# EasyEDA Pro project LuxcampBadge2025.epro, schematic Schematic

## Sheets
1 P1: Board Name: Board; Create Date: 2025-07-12; Page Name: P1; Project Name: Luxcamp Badge 2025; Schematic Name: Schematic; Update Date: 2025-07-19; Company: EasyEDA.com; Page Size: A4; Version: V1.0
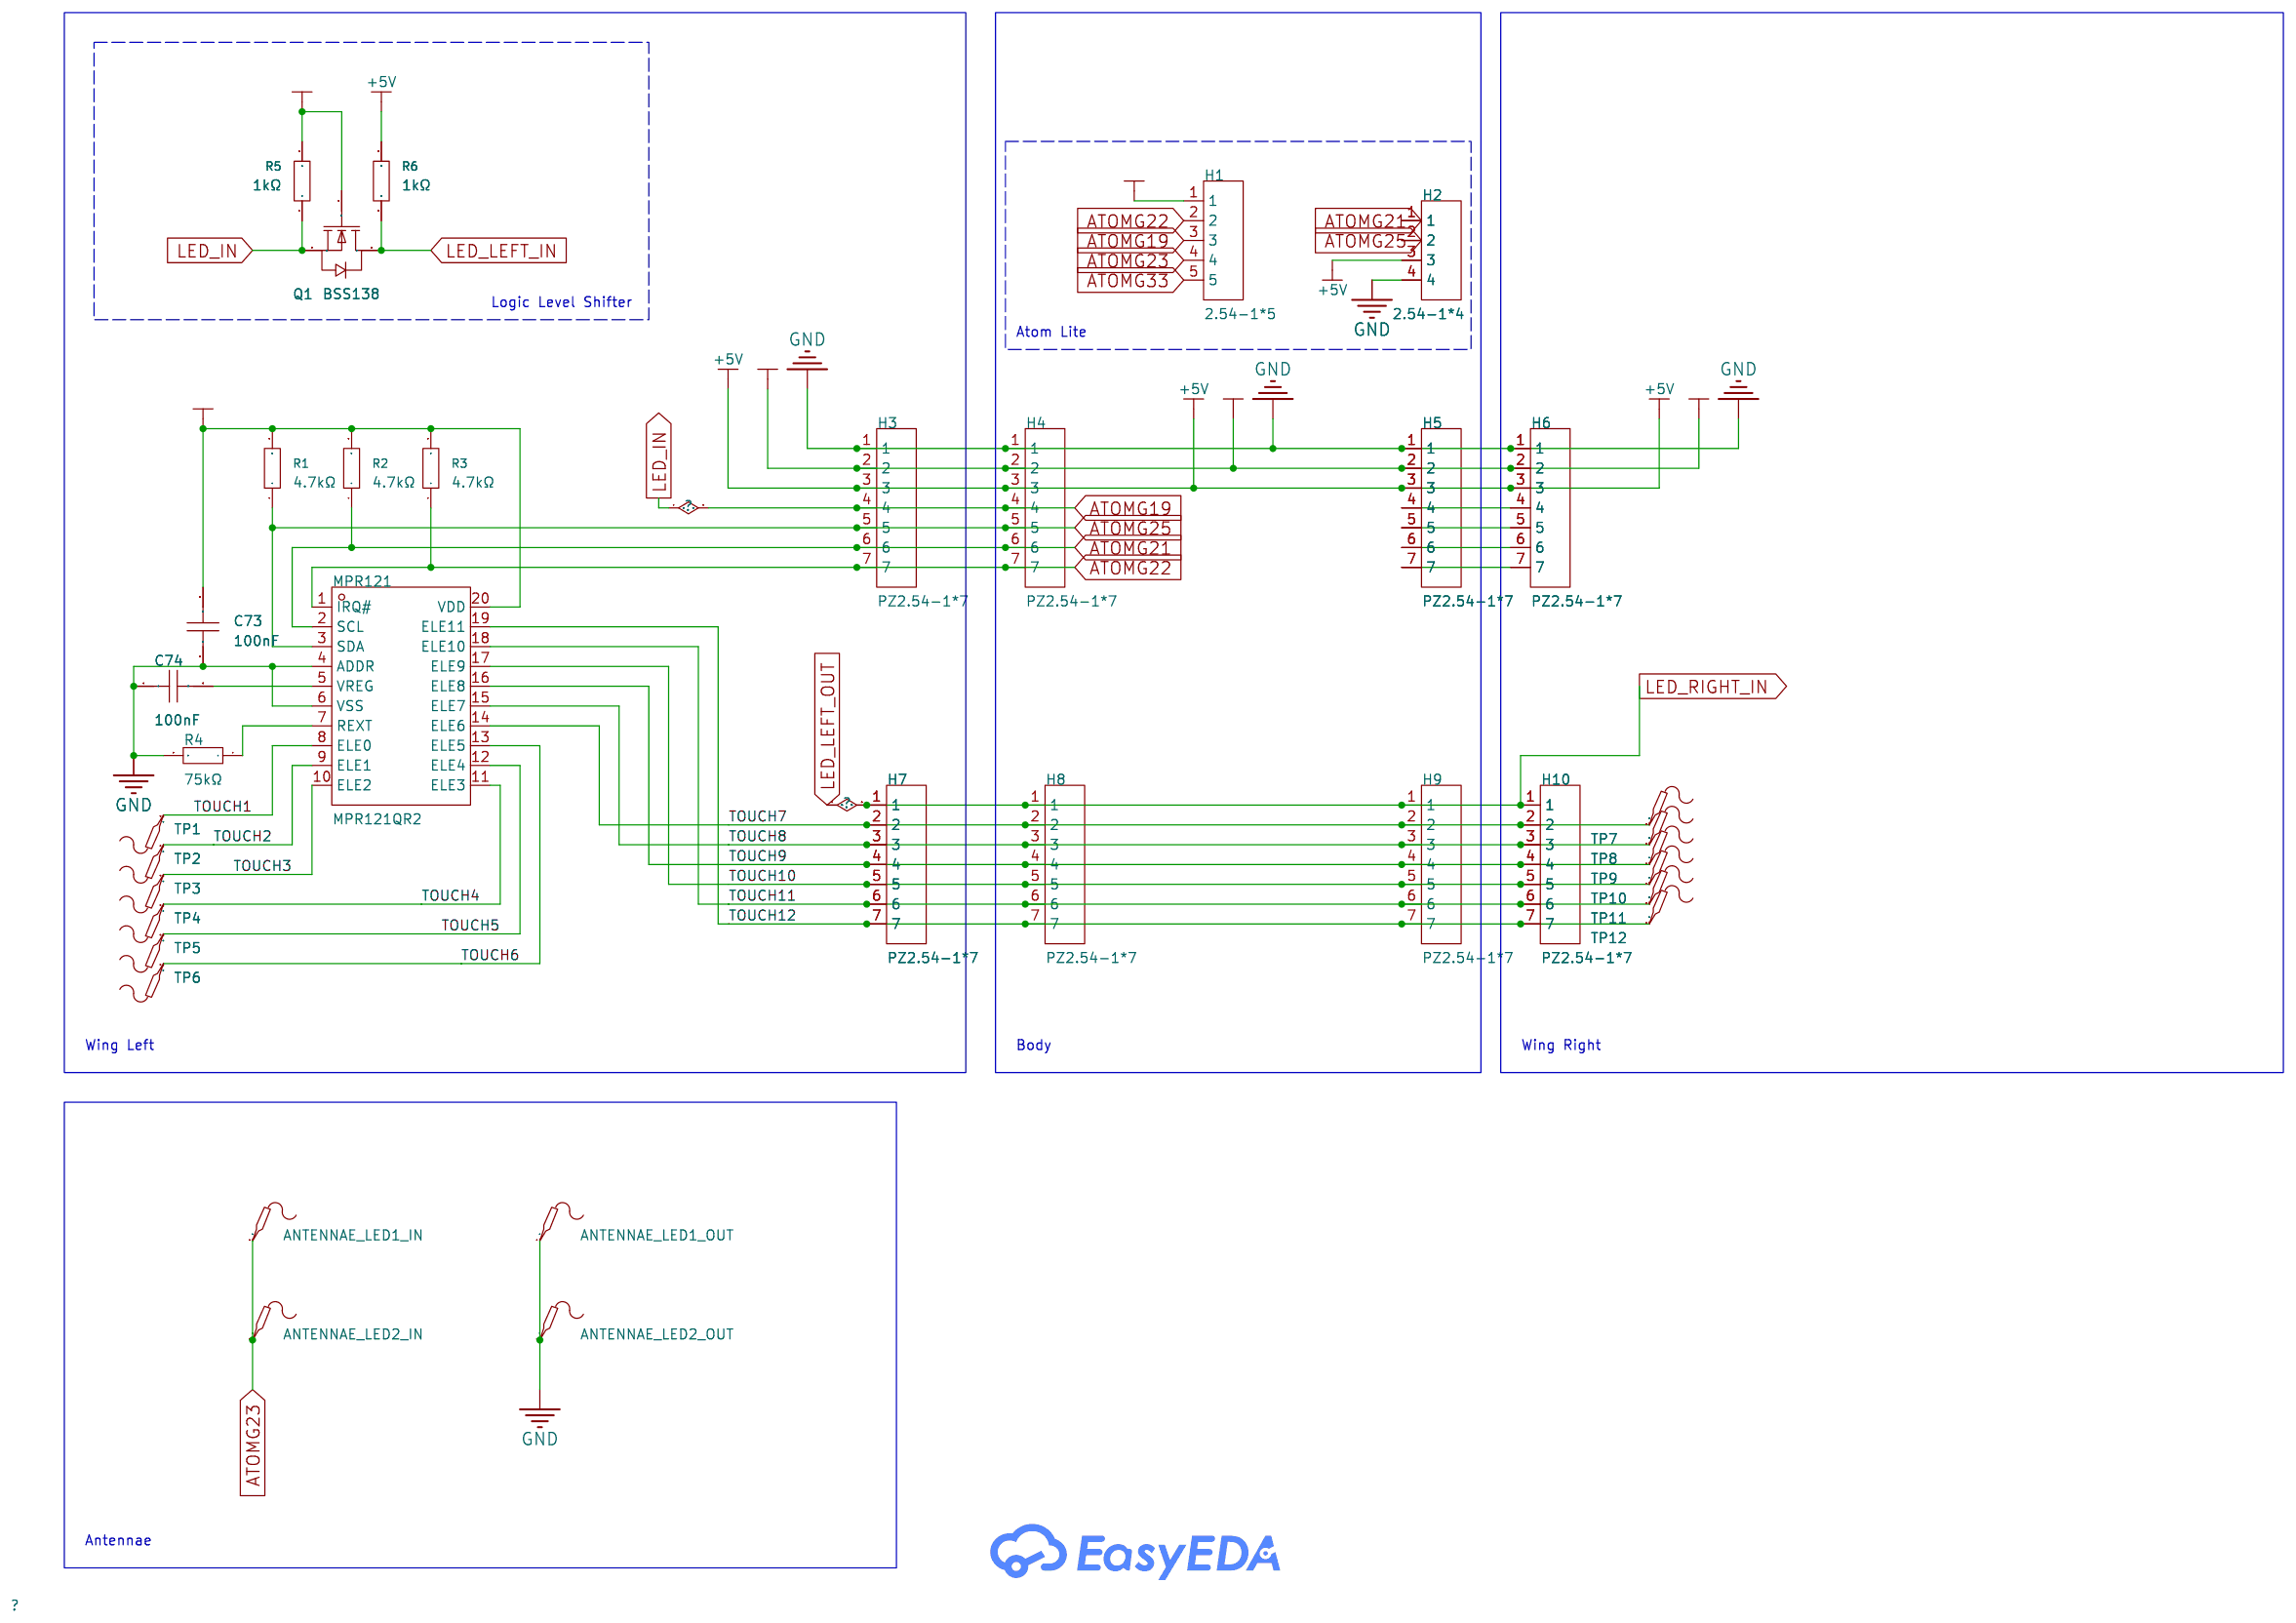
[diagram p2: P1]
2 LED_RIGHT: Create Date: 2025-07-03; Page Name: LED_RIGHT; Update Date: 2025-07-09
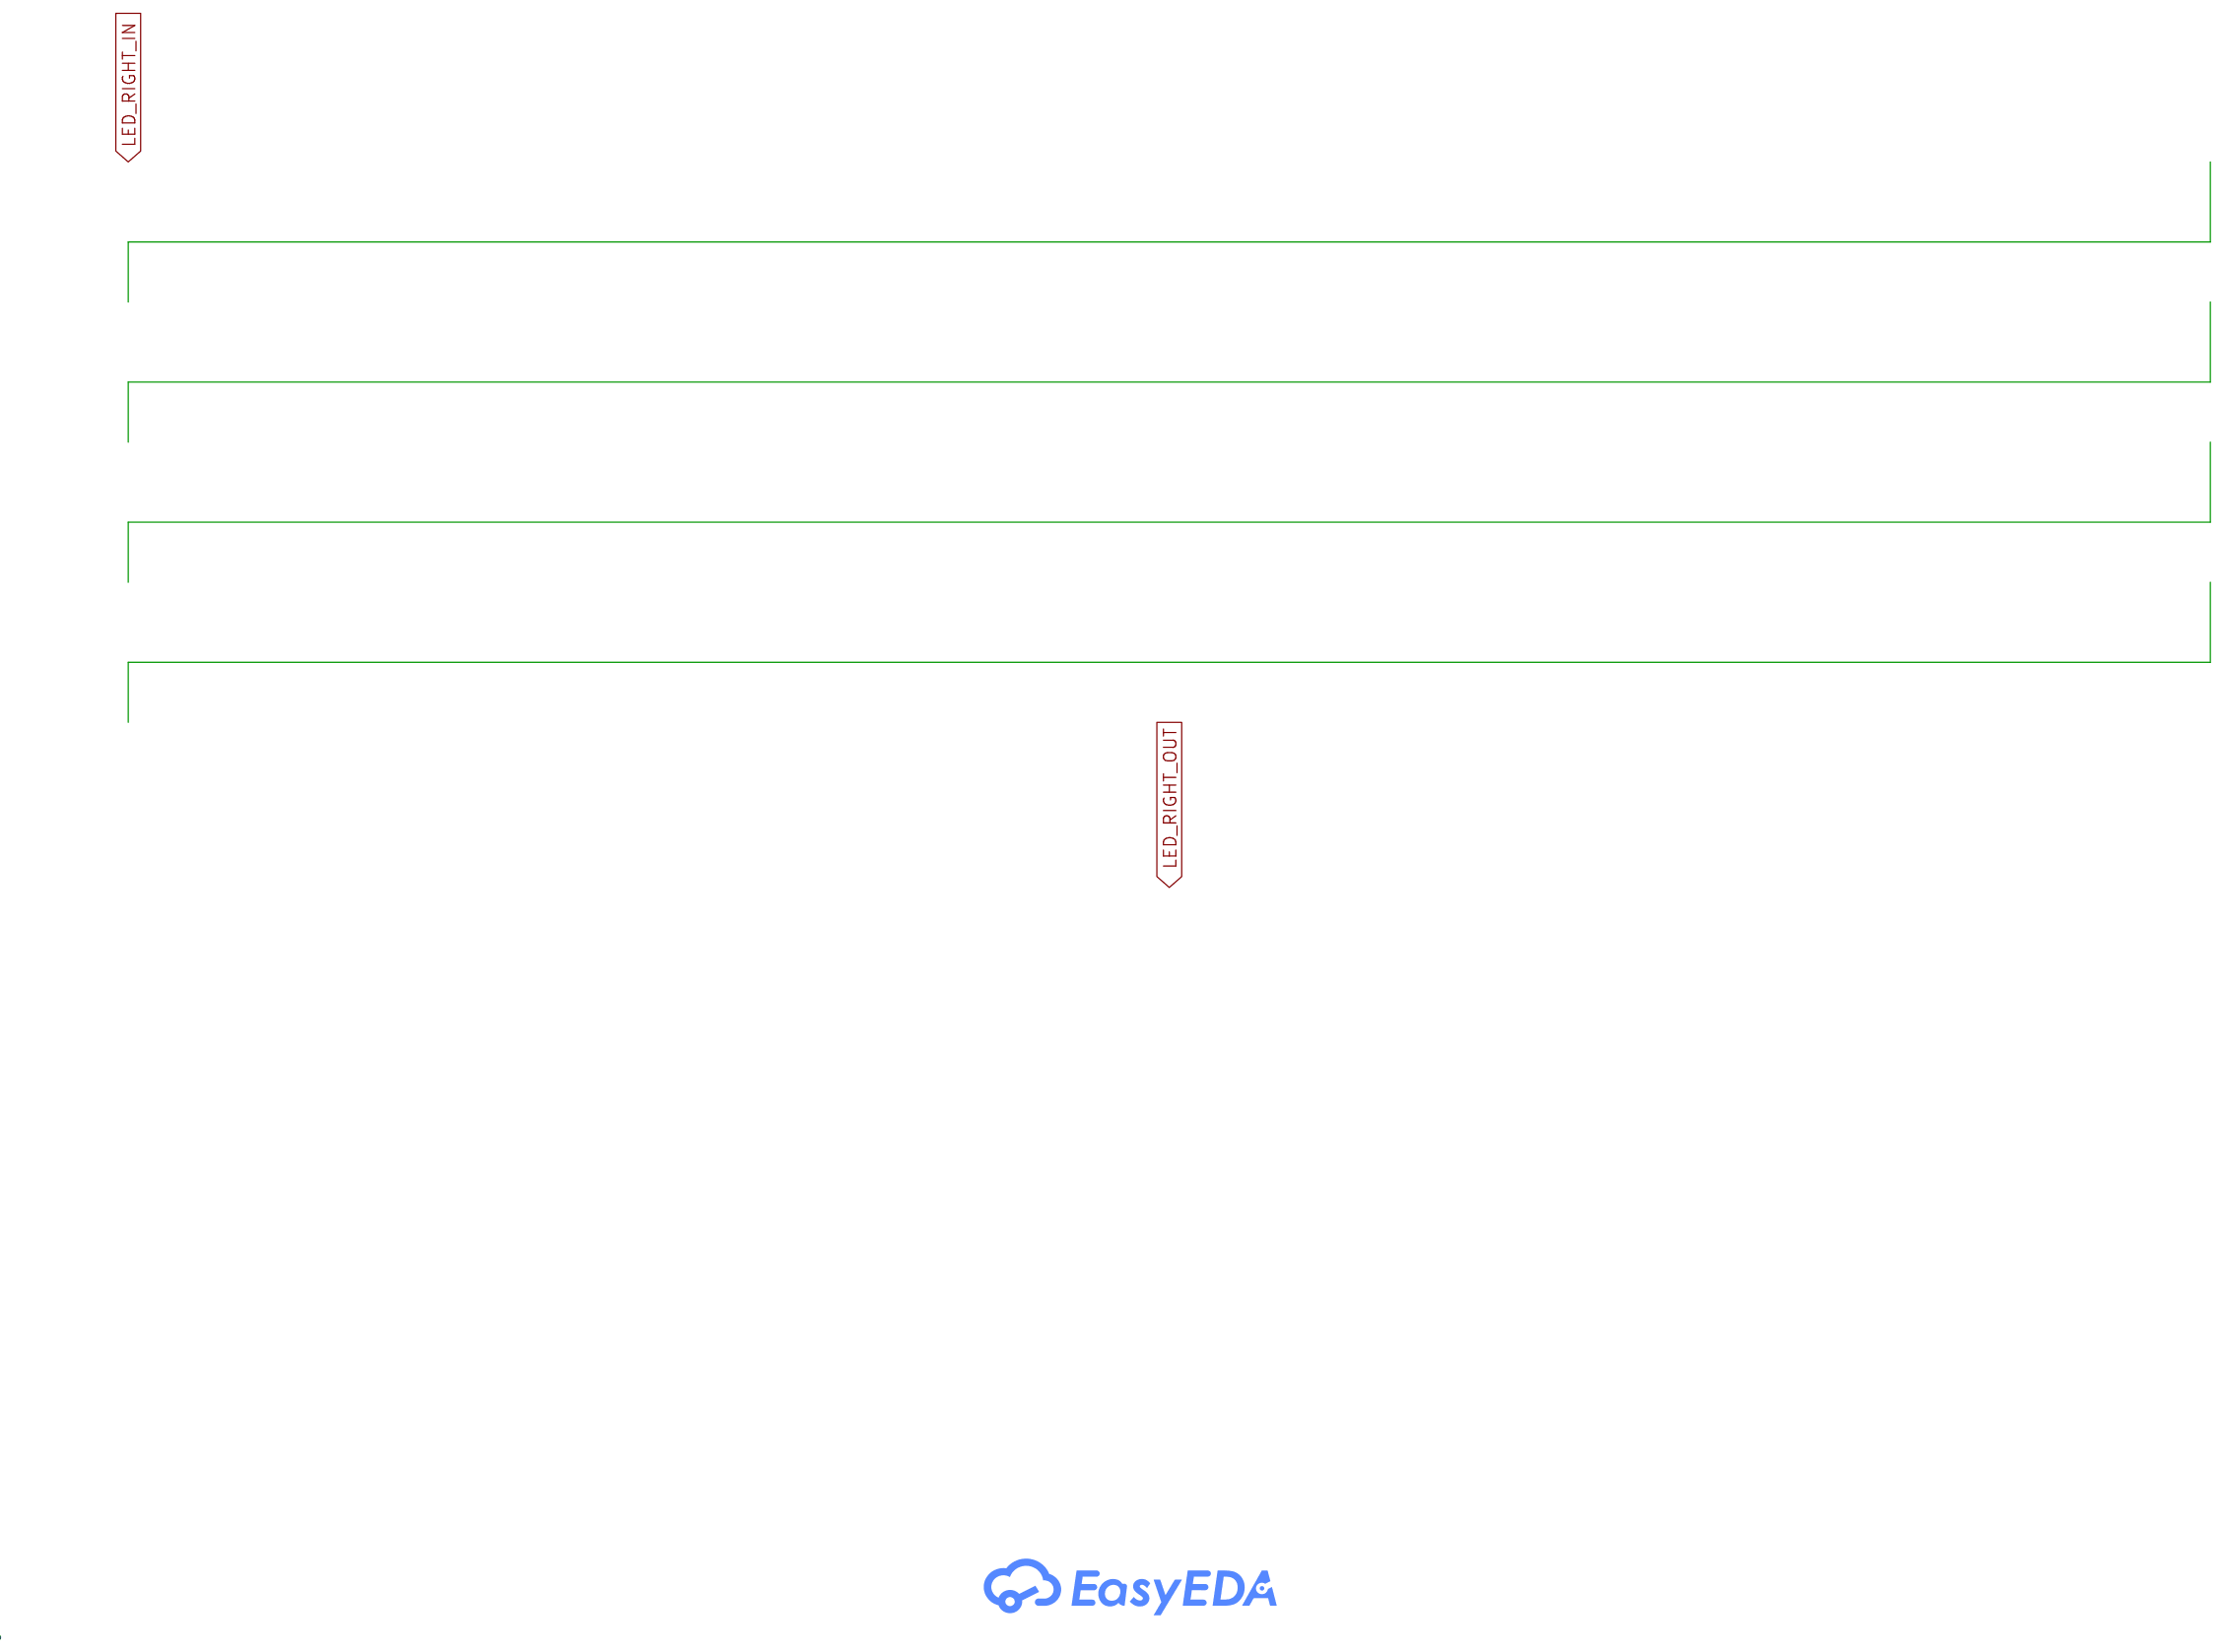
[diagram p3: LED_RIGHT]
3 LED_LEFT: Create Date: 2025-07-03; Page Name: LED_LEFT; Update Date: 2025-07-09
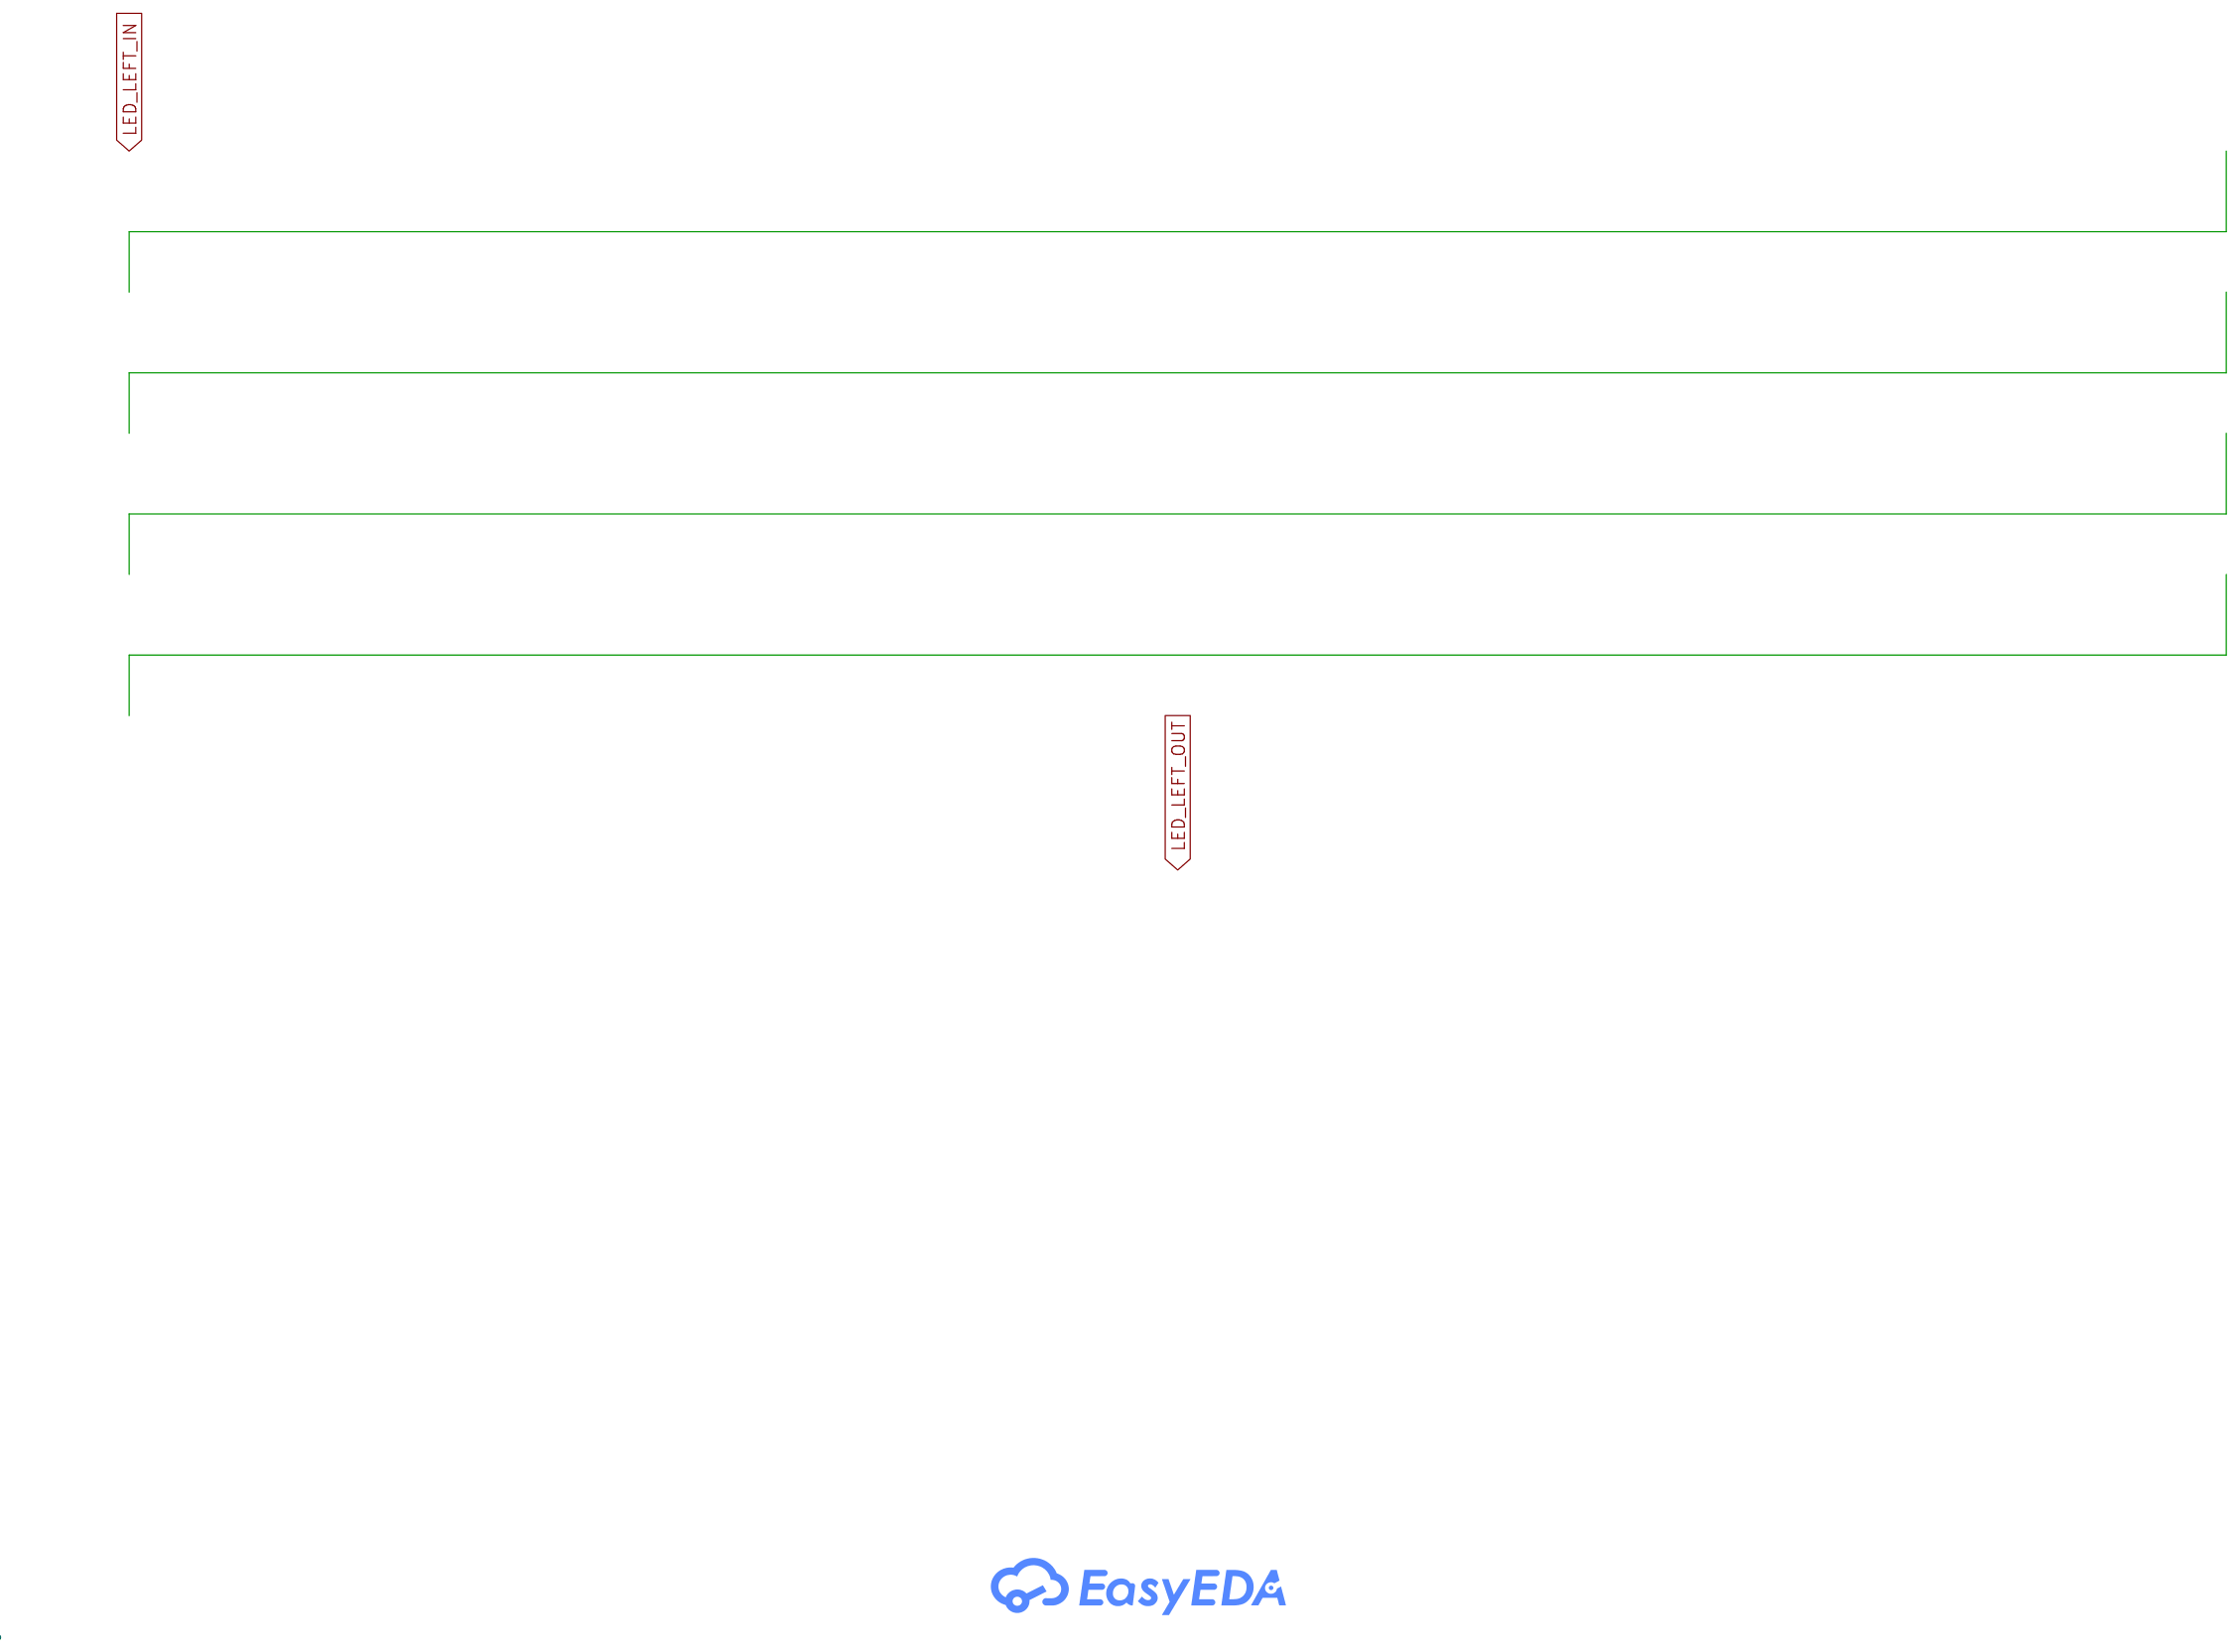
[diagram p4: LED_LEFT]

## Parts
sheet LED_LEFT
CBB1  -
CBB2  -
CBB3  -
CBB4  -
CBB5  -
CBB6  -
CBB7  -
CBB8  -
CBB9  -
CBB10  -
CBB11  -
CBB12  -
CBB13  -
CBB14  -
CBB15  -
CBB16  -
CBB17  -
CBB18  -
CBB19  -
CBB20  -
CBB21  -
CBB22  -
CBB23  -
CBB24  -
CBB25  -
CBB26  -
CBB27  -
CBB28  -
CBB29  -
CBB30  -
CBB31  -
CBB32  -
CBB33  -
CBB34  -
CBB35  -
CBB36  -
sheet LED_RIGHT
CBB37  -
CBB38  -
CBB39  -
CBB40  -
CBB41  -
CBB42  -
CBB43  -
CBB44  -
CBB45  -
CBB46  -
CBB47  -
CBB48  -
CBB49  -
CBB50  -
CBB51  -
CBB52  -
CBB53  -
CBB54  -
CBB55  -
CBB56  -
CBB57  -
CBB58  -
CBB59  -
CBB60  -
CBB61  -
CBB62  -
CBB63  -
CBB64  -
CBB65  -
CBB66  -
CBB67  -
CBB68  -
CBB69  -
CBB70  -
CBB71  -
CBB72  -
sheet P1
ANTENNAE_LED1_IN  -  [Test-Point-0.5mm]
ANTENNAE_LED1_OUT  -  [Test-Point-0.5mm]
ANTENNAE_LED2_IN  -  [Test-Point-0.5mm]
ANTENNAE_LED2_OUT  -  [Test-Point-0.5mm]
C73  100nF  [C0402]
C74  100nF  [C0402]
H1  2.54-1*5  [HDR-TH_5P-P2.54-V-M]
H2  2.54-1*4  [HDR-TH_4P-P2.54-V-M-1]
H3  PZ2.54-1*7  [HDR-TH_7P-P2.54-V-M]
H4  PZ2.54-1*7  [HDR-TH_7P-P2.54-V-M]
H5  PZ2.54-1*7  [HDR-TH_7P-P2.54-V-M]
H6  PZ2.54-1*7  [HDR-TH_7P-P2.54-V-M]
H7  PZ2.54-1*7  [HDR-TH_7P-P2.54-V-M]
H8  PZ2.54-1*7  [HDR-TH_7P-P2.54-V-M]
H9  PZ2.54-1*7  [HDR-TH_7P-P2.54-V-M]
H10  PZ2.54-1*7  [HDR-TH_7P-P2.54-V-M]
MPR121  MPR121QR2  [QFN-20_L3.0-W3.0-P0.40-BL]
Q1  BSS138  [SOT-23-3_L2.9-W1.3-P1.90-LS2.4-BR]
R1  4.7kΩ  [R0402]
R2  4.7kΩ  [R0402]
R3  4.7kΩ  [R0402]
R4  75kΩ  [R0402]
R5  1kΩ  [R0603]
R6  1kΩ  [R0603]
TP1  -  [Test-Point-0.5mm]
TP2  -  [Test-Point-0.5mm]
TP3  -  [Test-Point-0.5mm]
TP4  -  [Test-Point-0.5mm]
TP5  -  [Test-Point-0.5mm]
TP6  -  [Test-Point-0.5mm]
TP7  -  [Test-Point-0.5mm]
TP8  -  [Test-Point-0.5mm]
TP9  -  [Test-Point-0.5mm]
TP10  -  [Test-Point-0.5mm]
TP11  -  [Test-Point-0.5mm]
TP12  -  [Test-Point-0.5mm]

## Library data of the parts
ANTENNAE_LED1_IN ANTENNAE_LED1_OUT ANTENNAE_LED2_IN ANTENNAE_LED2_OUT TP1-TP12 = Test-Point: Test Point 测试点
C73 C74 = CGA0402X7R104K160GT: Capacitance:100nF Tolerance:±10% Tolerance:±10% Voltage Rated: Temperature Coefficient:; LCSC Part Name: 100nF ±10% 16V; Supplier Part: C6119799; Manufacturer: HRE(芯声); Supplier Footprint: 0402; JLCPCB Part Class: Extended Part; Supplier: LCSC; Tolerance: ±10%
H1 = 2.54-1*5: Pin Structure:1x5P Pitch:2.54mm Number of Rows:Single Row Number of Pins:5P; Supplier Part: C5156614; Manufacturer: ZHOURI(洲日); Supplier Footprint: 插件,P=2.54mm; JLCPCB Part Class: Extended Part; Datasheet: https://atta.szlcsc.com/upload/public/pdf/source/20250227/F941FC765EF241ABFB2D5D72948A31A5.pdf; Supplier: LCSC; Pin Structure: 1x5P; Pitch: 2.54mm; Number of Rows: Single Row; Number of Pins: 5P
H2 = 2.54-1*4: Pin Structure:1x4P Pitch:2.54mm Number of Rows:Single Row Number of Pins:4P; Supplier Part: C5116483; Manufacturer: ZHOURI(洲日); Supplier Footprint: 插件,P=2.54mm; JLCPCB Part Class: Extended Part; Datasheet: https://atta.szlcsc.com/upload/public/pdf/source/20250227/F941FC765EF241ABFB2D5D72948A31A5.pdf; Supplier: LCSC; Pin Structure: 1x4P; Pitch: 2.54mm; Number of Rows: Single Row; Number of Pins: 4P
H3-H10 = PZ2.54-1*7: Supplier Part: C5360900; Manufacturer: ZHOURI(洲日); Supplier Footprint: 插件,P=2.54mm; JLCPCB Part Class: Extended Part; Datasheet: https://atta.szlcsc.com/upload/public/pdf/source/20250227/F941FC765EF241ABFB2D5D72948A31A5.pdf; Supplier: LCSC
MPR121 = MPR121QR2: Supplier Part: C91322; Manufacturer: NXP(恩智浦); Supplier Footprint: QFN-20(3x3); JLCPCB Part Class: Extended Part; Datasheet: https://atta.szlcsc.com/upload/public/pdf/source/20240710/4D4C0BE290CAA2FB24355067A81EC58A.pdf; Supplier: LCSC
Q1 = BSS138_C489349: Type: Drain Source Voltage (Vdss): Continuous Drain Current (Id): Power Dissipation (Pd): Drain Source On Resistance (RDS(on)@Vgs,Id):2.5Ω@10V,220mA Gate Threshold Voltage (Vgs(th)@Id):1.5V@250A; LCSC Part Name: N沟道 50V 300mA; Supplier Part: C489349; Manufacturer: KEXIN(科信); Supplier Footprint: SOT23; JLCPCB Part Class: Extended Part; Datasheet: https://atta.szlcsc.com/upload/public/pdf/source/20200225/C489349_F11039DA064D6FF18A45C7D002538134.pdf; Supplier: LCSC; Drain Source On Resistance (RDS(on)@Vgs,Id): 2.5Ω@10V,220mA; Gate Threshold Voltage (Vgs(th)@Id): 1.5V@250A
R1-R3 = 0402WGJ0472TCE: Type:Thick Film Resistors Resistance:4.7kΩ Tolerance:±5% Tolerance:±5% Power(Watts): Overload Voltage (Max): Temperature Coefficient:±100ppm/℃ Temperature Coefficient:±100ppm/℃ Operating Temperature Range:-55℃~+155℃ Operating Temperature Range:-55℃~+155℃; LCSC Part Name: 4.7kΩ ±5% 62.5mW 厚膜电阻; Supplier Part: C25940; Manufacturer: UNI-ROYAL(厚声); Supplier Footprint: 0402; JLCPCB Part Class: Extended Part; Datasheet: https://atta.szlcsc.com/upload/public/pdf/source/20200306/C422600_1E6D84923E4A46A82E41ADD87F860B5C.pdf; Supplier: LCSC; Type: Thick Film Resistors; Tolerance: ±5%; Temperature Coefficient: ±100ppm/℃; Operating Temperature Range: -55℃~+155℃
R4 = 0402WGF7502TCE: Type:Thick Film Resistors Resistance:75kΩ Tolerance:±1% Tolerance:±1% Power(Watts): Overload Voltage (Max): Temperature Coefficient:±100ppm/℃ Temperature Coefficient:±100ppm/℃ Operating Temperature Range:-55℃~+155℃ Operating Temperature Range:-55℃~+155℃; LCSC Part Name: 75kΩ ±1% 62.5mW 厚膜电阻; Supplier Part: C25798; Manufacturer: UNI-ROYAL(厚声); Supplier Footprint: 0402; JLCPCB Part Class: Extended Part; Datasheet: https://atta.szlcsc.com/upload/public/pdf/source/20200306/C422600_1E6D84923E4A46A82E41ADD87F860B5C.pdf; Supplier: LCSC; Type: Thick Film Resistors; Tolerance: ±1%; Temperature Coefficient: ±100ppm/℃; Operating Temperature Range: -55℃~+155℃
R5 R6 = 0603WAJ0102T5E: Type:Thick Film Resistors Resistance:1kΩ Tolerance:±5% Tolerance:±5% Power(Watts): Overload Voltage (Max): Temperature Coefficient:±100ppm/℃ Temperature Coefficient:±100ppm/℃ Operating Temperature Range:-55℃~+155℃ Operating Temperature Range:-55℃~+155℃; LCSC Part Name: 1kΩ ±5% 100mW 厚膜电阻; Supplier Part: C25585; Manufacturer: UNI-ROYAL(厚声); Supplier Footprint: 0603; JLCPCB Part Class: Extended Part; Datasheet: https://atta.szlcsc.com/upload/public/pdf/source/20200306/C422600_1E6D84923E4A46A82E41ADD87F860B5C.pdf; Supplier: LCSC; Type: Thick Film Resistors; Tolerance: ±5%; Temperature Coefficient: ±100ppm/℃; Operating Temperature Range: -55℃~+155℃

## Nets
3V3: C73.2 H1.1 H3.2 H4.2 H5.2 H6.2 MPR121.20(VDD) Q1.1(G) R1.2 R2.2 R3.2 R5.2
+5V: H2.3 H3.3 H4.3 H5.3 H6.3 R6.2
GND: ANTENNAE_LED1_OUT.1 ANTENNAE_LED2_OUT.1 C73.1 C74.1 H2.4 H3.1 H4.1 H5.1 H6.1 MPR121.4(ADDR) MPR121.6(VSS) R4.2
ATOMG19: H1.3 H3.4 H4.4 Q1.2(S) R5.1
ATOMG21: H2.1 H3.6 H4.6 MPR121.2(SCL) R2.1
ATOMG22: H1.2 H3.7 H4.7 MPR121.1(IRQ#) R3.1
ATOMG23: ANTENNAE_LED1_IN.1 ANTENNAE_LED2_IN.1 H1.4
ATOMG25: H2.2 H3.5 H4.5 MPR121.3(SDA) R1.1
ATOMG33: H1.5
LED_LEFT_IN: CBB1.(LED_OUT) CBB2.(LED_OUT) CBB3.(LED_OUT) CBB4.(LED_OUT) CBB5.(LED_OUT) CBB6.(LED_OUT) CBB7.(LED_OUT) CBB8.(LED_OUT) CBB9.(LED_OUT) CBB10.(LED_OUT) CBB11.(LED_OUT) CBB12.(LED_OUT) CBB13.(LED_OUT) CBB14.(LED_OUT) CBB15.(LED_OUT) CBB16.(LED_OUT) CBB17.(LED_OUT) CBB18.(LED_OUT) CBB19.(LED_OUT) CBB20.(LED_OUT) CBB21.(LED_OUT) CBB22.(LED_OUT) CBB23.(LED_OUT) CBB24.(LED_OUT) CBB25.(LED_OUT) CBB26.(LED_OUT) CBB27.(LED_OUT) CBB28.(LED_OUT) CBB29.(LED_OUT) CBB30.(LED_OUT) CBB31.(LED_OUT) CBB32.(LED_OUT) CBB33.(LED_OUT) CBB34.(LED_OUT) CBB35.(LED_OUT) CBB36.(LED_OUT) CBB37.(LED_OUT) CBB38.(LED_OUT) CBB39.(LED_OUT) CBB40.(LED_OUT) CBB41.(LED_OUT) CBB42.(LED_OUT) CBB43.(LED_OUT) CBB44.(LED_OUT) CBB45.(LED_OUT) CBB46.(LED_OUT) CBB47.(LED_OUT) CBB48.(LED_OUT) CBB49.(LED_OUT) CBB50.(LED_OUT) CBB51.(LED_OUT) CBB52.(LED_OUT) CBB53.(LED_OUT) CBB54.(LED_OUT) CBB55.(LED_OUT) CBB56.(LED_OUT) CBB57.(LED_OUT) CBB58.(LED_OUT) CBB59.(LED_OUT) CBB60.(LED_OUT) CBB61.(LED_OUT) CBB62.(LED_OUT) CBB63.(LED_OUT) CBB64.(LED_OUT) CBB65.(LED_OUT) CBB66.(LED_OUT) CBB67.(LED_OUT) CBB68.(LED_OUT) CBB69.(LED_OUT) CBB70.(LED_OUT) CBB71.(LED_OUT) CBB72.(LED_OUT) H7.1 H8.1 H9.1 H10.1 Q1.3(D) R6.1
TOUCH1: MPR121.8(ELE0) TP1.1
TOUCH2: MPR121.9(ELE1) TP2.1
TOUCH3: MPR121.10(ELE2) TP3.1
TOUCH4: MPR121.11(ELE3) TP4.1
TOUCH5: MPR121.12(ELE4) TP5.1
TOUCH6: MPR121.13(ELE5) TP6.1
TOUCH7: H7.2 H8.2 H9.2 H10.2 MPR121.14(ELE6) TP7.1
TOUCH8: H7.3 H8.3 H9.3 H10.3 MPR121.15(ELE7) TP8.1
TOUCH9: H7.4 H8.4 H9.4 H10.4 MPR121.16(ELE8) TP9.1
TOUCH10: H7.5 H8.5 H9.5 H10.5 MPR121.17(ELE9) TP10.1
TOUCH11: H7.6 H8.6 H9.6 H10.6 MPR121.18(ELE10) TP11.1
TOUCH12: H7.7 H8.7 H9.7 H10.7 MPR121.19(ELE11) TP12.1
$1N10297: MPR121.7(REXT) R4.1
$1N10451: C74.2 MPR121.5(VREG)
$1N12824: H5.4 H6.4
$1N12826: H5.5 H6.5
$1N12828: H5.6 H6.6
$1N12830: H5.7 H6.7

## Notes on the sheets
sheet 1
- Logic Level Shifter
- Atom Lite
- Wing Left
- Body
- Wing Right
- Antennae
